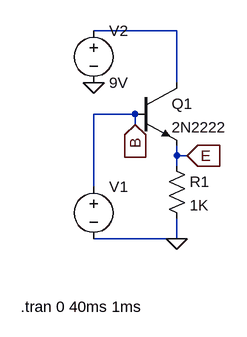
[diagram p0: schematic Emitter Follower.asc]
Emitter Follower.asc, the LTspice schematic file:
Version 4
SHEET 1 880 680
WIRE 304 112 176 112
WIRE 304 192 304 112
WIRE 240 240 176 240
WIRE 240 256 240 240
WIRE 304 304 304 288
WIRE 320 304 304 304
WIRE 304 320 304 304
WIRE 176 352 176 240
WIRE 304 432 304 400
WIRE 304 432 176 432
FLAG 304 432 0
FLAG 176 192 0
FLAG 240 256 B
IOPIN 240 256 In
FLAG 320 304 E
IOPIN 320 304 In
SYMBOL npn 240 192 R0
SYMATTR InstName Q1
SYMATTR Value 2N2222
SYMBOL voltage 176 336 R0
WINDOW 3 24 96 Invisible 2
SYMATTR InstName V1
SYMATTR Value SINE(4 4 100 0 0 0 4)
SYMBOL res 288 304 R0
SYMATTR InstName R1
SYMATTR Value 1K
SYMBOL voltage 176 96 R0
SYMATTR InstName V2
SYMATTR Value 9V
TEXT 64 536 Left 2 !.tran 0 40ms 1ms

The netlist it stands for:
* Emitter Follower.asc
Q1 N001 B E 0 2N2222
V1 B 0 SINE(4 4 100 0 0 0 4)
R1 E 0 1K
V2 N001 0 9V
.model NPN NPN
.model PNP PNP
.lib standard.bjt
.tran 0 40ms 1ms
.backanno
.end